# Altium schematic sheet 电源电路.SchDoc
size A
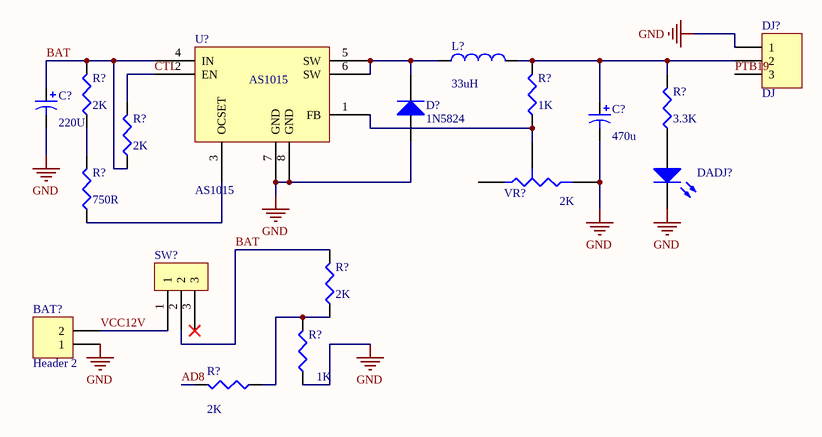
[diagram p0: 电源电路.SchDoc]

## Parts
(Parts that share a designator on the sheet are numbered #1, #2 ... from top to bottom, then left to right.)
BAT?  Header 2  [power1]
C?#1  value 220U  [rb -5]
C?#2  value 470u  [3527]
D?  1N5824  [1812_DIODE]
DADJ?  (no value)  [3.2X1.6X1.1]
DJ?  DJ  [HDR1X3]
L?  value 33uH  [CL1010]
R?#1  value 2K  [J1-0603]
R?#2  value 1K  [J1-0603]
R?#3  value 3.3K  [J1-0603]
R?#4  value 2K  [J1-0603]
R?#5  value 750R  [J1-0603]
R?#6  value 2K  [J1-0603]
R?#7  value 1K  [J1-0603]
R?#8  value 2K  [J1-0603]
SW?  (no value)  [钮子开关 - duplicate]
U?  AS1015  [SOP8L]
VR?  value 2K  [3362]

## Nets
GND: BAT?.1 C?#1.2 C?#2.2 D?.1(A) DADJ?.2(K) DJ?.1 R?#7.1 U?.7(GND) U?.8(GND) VR?.2(B)
AD8: R?#8.2
BAT: C?#1.1 R?#1.2 R?#4.1 R?#6.2 SW?.2 U?.4(IN)
CTL: R?#4.2 U?.2(EN)
PTB19: DJ?.3
VCC12V: BAT?.2 SW?.1
NetC?#2_1: C?#2.1 DJ?.2 L?.2 R?#2.2 R?#3.2
NetD?_2: D?.2(K) L?.1 U?.5(SW) U?.6(SW)
NetDADJ?_1: DADJ?.1(A) R?#3.1
NetR?#1_1: R?#1.1 R?#5.2
NetR?#2_1: R?#2.1 U?.1(FB) VR?.3(TAP)
NetR?#5_1: R?#5.1 U?.3(OCSET)
NetR?#6_1: R?#6.1 R?#7.2 R?#8.1

Not connected (* = marked no-connect by the designer): SW? 3*; VR? 1(A)

## Library data of the parts
BAT? = Header 2: Header, 2-Pin; LatestRevisionDate: 17-Jul-2002; LatestRevisionNote: Re-released for DXP Platform.; Publisher: Altium Limited
C?#1 = Cap Pol1: Polarized Capacitor (Radial); Published: 8-Jun-2000; LatestRevisionDate: 17-Jul-2002; LatestRevisionNote: Re-released for DXP Platform.; PackageReference: RB7.6-15; Publisher: Altium Limited; PackageDescription: Polarized Capacitor (Radial); 2 Leads
C?#2 = Cap Pol3: Polarized Capacitor (Surface Mount); Published: 8-Jun-2000; LatestRevisionDate: 29-May-2009; LatestRevisionNote: IPC-7351 Footprint Added.; PackageReference: C0805; Publisher: Altium Limited; PackageDescription: Chip Capacitor
D? = Diode: Default Diode; Published: 8-Jun-2000; LatestRevisionDate: 17-Jul-2002; LatestRevisionNote: Re-released for DXP Platform.; PackageVersion: Sep-1996; PackageReference: SMC; Publisher: Altium Limited; PackageDescription: DO-214-AB/SMC; 2 C-Bend Leads; Body 7.9 x 5.9 mm, inc. leads (LxW); Code_JEDEC: DO-214-AB
DADJ? = LED3: Typical BLUE SiC LED; Published: 8-Jun-2000; LatestRevisionDate: 17-Dec-2003; LatestRevisionNote: PCB Footprint replaced.; DatasheetVersion: 16-Apr-2002; PackageVersion: 16-Apr-2002; PackageReference: 3.5X2.8X1.9; Publisher: Altium Limited; PackageDescription: SM LED; 2 C-Bend Leads; Body 3.5 x 2.8 x 1.9 mm, inc leads (LxWxH typ)
DJ? = Header 3: Header, 3-Pin; LatestRevisionDate: 17-Jul-2002; LatestRevisionNote: Re-released for DXP Platform.; Publisher: Altium Limited
L? = Inductor: Code_IEC: 1005; Published: 8-Jun-2000; LatestRevisionDate: 29-May-2009; LatestRevisionNote: IPC-7351 Footprint Added.; PackageReference: 0402-A; Publisher: Altium Limited; PackageDescription: Chip Inductor; Code_JEITA: 0402
R?#1-R?#8 = Res3: Resistor; Published: 8-Jun-2000; LatestRevisionDate: 29-May-2009; LatestRevisionNote: IPC-7351 Footprint Added.; PackageReference: J1-0603; Publisher: Altium Limited; PackageDescription: Chip Resistor
SW? = 钮子开关
VR? = Res Tap: Tapped Resistor; Sim Note: Enter the Resistance value and the set point into parameter fields.; Set Position: 0.5; Published: 24-Mar-1999; LatestRevisionDate: 17-Jul-2002; LatestRevisionNote: Re-released for DXP Platform.; PackageReference: VR3; Publisher: Altium Limited; PackageDescription: Variable Resistor, Thru-Hole; 3 Leads